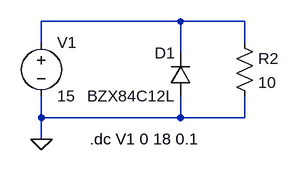
[diagram p0: schematic 2.6-Draft.asc]
2.6-Draft.asc, the LTspice schematic file:
Version 4.1
SHEET 1 880 680
WIRE 240 96 32 96
WIRE 336 96 240 96
WIRE 32 128 32 96
WIRE 336 128 336 96
WIRE 240 144 240 96
WIRE 32 240 32 208
WIRE 240 240 240 208
WIRE 240 240 32 240
WIRE 336 240 336 208
WIRE 336 240 240 240
WIRE 32 272 32 240
FLAG 32 272 0
SYMBOL voltage 32 112 R0
WINDOW 123 0 0 Left 0
WINDOW 39 0 0 Left 0
SYMATTR InstName V1
SYMATTR Value 15
SYMBOL res 320 112 R0
SYMATTR InstName R2
SYMATTR Value 10
SYMBOL diode 256 208 R180
WINDOW 0 24 64 Left 2
WINDOW 3 24 0 Left 2
SYMATTR InstName D1
SYMATTR Value BZX84C12L
SYMATTR Description Diode
SYMATTR Type diode
TEXT 104 272 Left 2 !.dc V1 0 18 0.1

The netlist it stands for:
* 2.6-Draft.asc
V1 N001 0 15
R2 N001 0 10
D1 0 N001 BZX84C12L
.model D D
.lib standard.dio
.dc V1 0 18 0.1
.backanno
.end